# EAGLE design EMBEDDED (EAGLE 6.5.0)
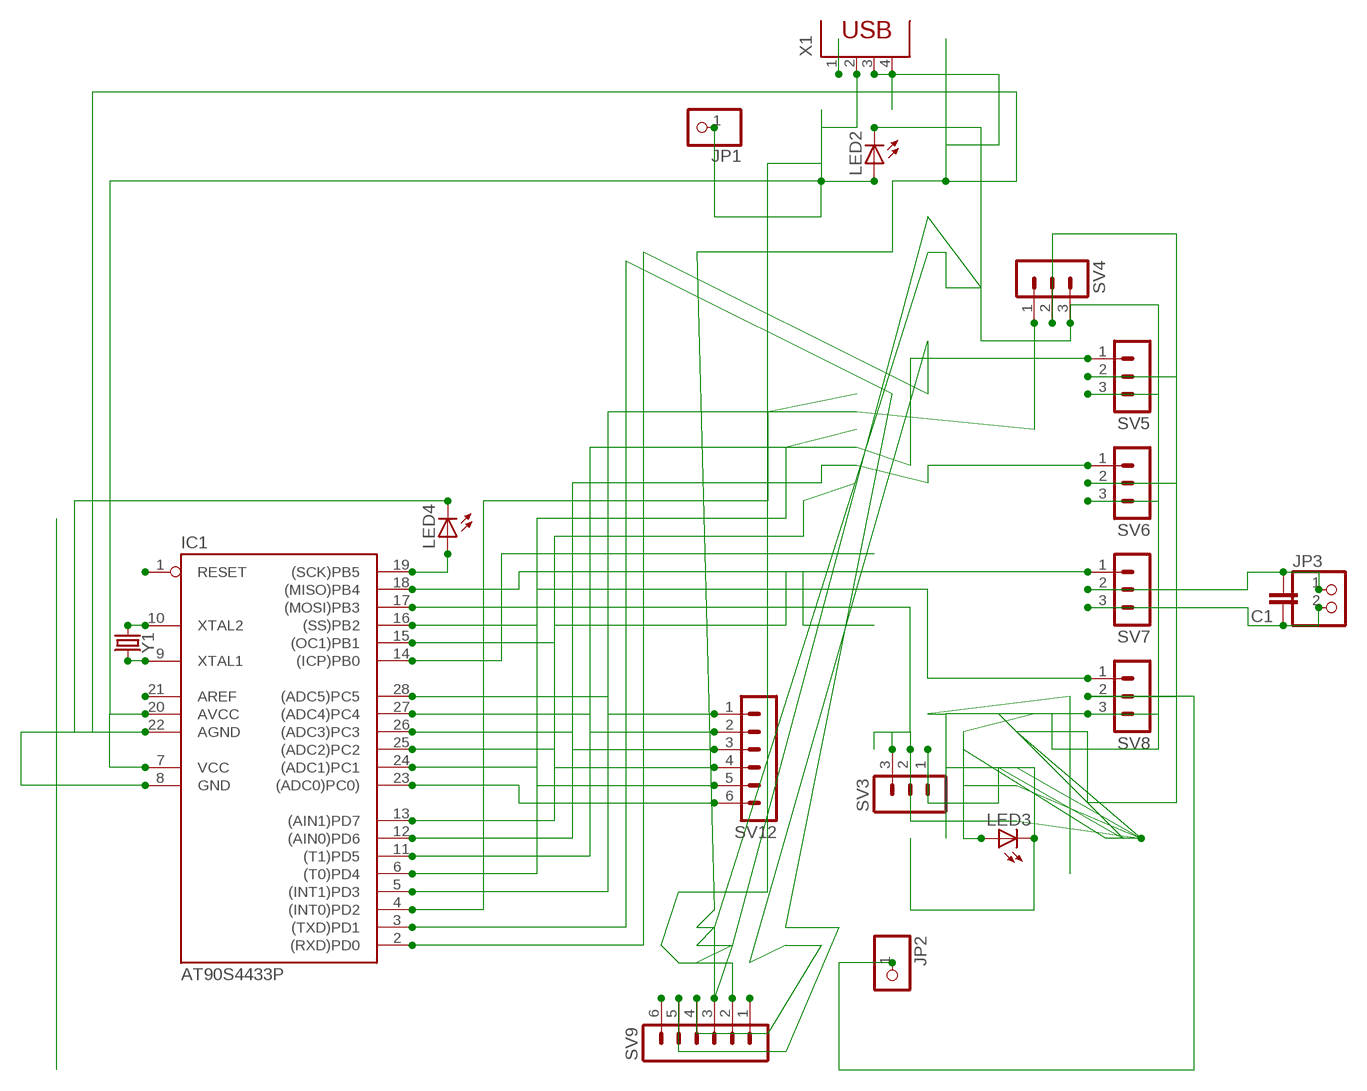
[diagram p0: schematic, sheet 1]

## Parts
C1  C5/2.5  [C5B2.5]
IC1  AT90S4433P  [DIL28-3]
JP1  PINHD-1X1  [1X01]
JP2  PINHD-1X1  [1X01]
JP3  PINHD-1X2  [1X02]
LED2  LEDLD260  [LD260]
LED3  LEDLD260  [LD260]
LED4  LEDLD260  [LD260]
SV3  MA03-1  [MA03-1]
SV4  MA03-1  [MA03-1]
SV5  MA03-1  [MA03-1]
SV6  MA03-1  [MA03-1]
SV7  MA03-1  [MA03-1]
SV8  MA03-1  [MA03-1]
SV9  MA06-1  [MA06-1]
SV12  MA06-1  [MA06-1]
X1  PN61729  [PN61729]
Y1  CRYSTALPTH-HC49US  [HC49US]

## Nets
GROUND: C1.1 IC1.8(GND) IC1.22(AGND) JP3.2 LED2.K(C) LED3.K(C) LED4.K(C) SV3.1 SV4.3 SV5.3 SV6.3 SV7.3 SV8.3 SV9.3 X1.3
N$1: IC1.17((MOSI)PB3) SV3.3
N$3: X1.1
N$4: X1.4
N$5: C1.2 JP2.1 JP3.1 LED3.A SV3.2 SV4.2 SV5.2 SV6.2 SV7.2 SV8.2
N$10: IC1.16((SS)PB2) SV8.1
N$12: IC1.15((OC1)PB1) SV7.1
N$15: IC1.12((AIN0)PD6) SV6.1
N$18: IC1.28((ADC5)PC5) SV12.1
N$19: IC1.11((T1)PD5) SV5.1
N$20: IC1.21(AREF)
N$21: IC1.9(XTAL1) Y1.2
N$22: IC1.5((INT1)PD3) SV4.1
N$23: SV9.6
N$24: IC1.27((ADC4)PC4) SV12.2
N$25: IC1.26((ADC3)PC3) SV12.3
N$26: IC1.2((RXD)PD0) SV9.4
N$27: IC1.3((TXD)PD1) SV9.5
N$28: SV9.1
N$29: IC1.25((ADC2)PC2) SV12.4
N$30: IC1.24((ADC1)PC1) SV12.5
N$31: IC1.23((ADC0)PC0)) SV12.6
N$32: IC1.10(XTAL2) Y1.1
N$33: IC1.1(RESET)
N$35: IC1.4((INT0)PD2)
N$37: IC1.6((T0)PD4)
N$40: IC1.13((AIN1)PD7)
N$41: IC1.14((ICP)PB0)
N$46: IC1.18((MISO)PB4)
N$54: IC1.19((SCK)PB5) LED4.A
VOLTAGE: IC1.7(VCC) IC1.20(AVCC) JP1.1 LED2.A SV9.2 X1.2

## Library data of the parts
C1 = capacitor-wima:C: CAPACITOR naming: grid - package width
IC1 = atmel:AT90S4433: MICROCONTROLLER 4 Kbytes FLASH 128 bytes SRAM 256 bytes EEPROM UART 6-channel 10 bit ADC; OC_FARNELL: unknown; OC_NEWARK: unknown
JP1 JP2 = pinhead:PINHD-1X1: PIN HEADER
JP3 = pinhead:PINHD-1X2: PIN HEADER
LED2-LED4 = led:LED: LED OSRAM: - CHIPLED LG R971, LG N971, LY N971, LG Q971, LY Q971, LO R971, LY R971 LH N974, LH R974 LS Q976, LO Q976, LY Q976 LO Q996 - Hyper CHIPLED LW Q18S LB Q993, LB Q99A, LB R99A - SideLED LS A670, LO A670, LY A670, LG A670, LP A670 LB A673, LV A673, LT A673, LW A673 LH A674 LY A675 LS A676, LA A676, LO A676, LY A676, LW A676 LS A679, LY A679, LG A679 - Hyper Micro SIDELED® LS Y876, LA Y876, LO Y876, LY Y876 LT Y87S - SmartLED LW L88C, LW L88S LB L89C, LB L89S, LG L890 LS L89K, LO L89K, LY L89K LS L896, LA L896, LO L896, LY L896 - TOPLED LS T670, LO T670, LY T670, LG T670, LP T670 LSG T670, LSP T670, LSY T670, LOP T670, LYG T670 LG T671, LOG T671, LSG T671 LB T673, LV T673, LT T673, LW T673 LH T674 LS T676, LA T676, LO T676, LY T676, LB T676, LH T676, LSB T676, LW T676 LB T67C, LV T67C, LT T67C, LS T67K, LO T67K, LY T67K, LW E67C LS E67B, LA E67B, LO E67B, LY E67B, LB E67C, LV E67C, LT E67C LW T67C LS T679, LY T679, LG T679 LS T770, LO T770, LY T770, LG T770, LP T770 LB T773, LV T773, LT T773, LW T773 LH T774 LS E675, LA E675, LY E675, LS T675 LS T776, LA T776, LO T776, LY T776, LB T776 LHGB T686 LT T68C, LB T68C - Hyper Mini TOPLED® LB M676 - Mini TOPLED Santana® LG M470 LS M47K, LO M47K, LY M47K Source: http://www.osram.convergy.de LUXEON: - LUMILED® LXK2-PW12-R00, LXK2-PW12-S00, LXK2-PW14-U00, LXK2-PW14-V00 LXK2-PM12-R00, LXK2-PM12-S00, LXK2-PM14-U00 LXK2-PE12-Q00, LXK2-PE12-R00, LXK2-PE12-S00, LXK2-PE14-T00, LXK2-PE14-U00 LXK2-PB12-K00, LXK2-PB12-L00, LXK2-PB12-M00, LXK2-PB14-N00, LXK2-PB14-P00, LXK2-PB14-Q00 LXK2-PR12-L00, LXK2-PR12-M00, LXK2-PR14-Q00, LXK2-PR14-R00 LXK2-PD12-Q00, LXK2-PD12-R00, LXK2-PD12-S00 LXK2-PH12-R00, LXK2-PH12-S00 LXK2-PL12-P00, LXK2-PL12-Q00, LXK2-PL12-R00 Source: www.luxeon.com KINGBRIGHT: KA-3528ASYC Source: www.kingbright.com
SV3-SV8 = con-lstb:MA03-1: PIN HEADER; OC_FARNELL: unknown; OC_NEWARK: unknown
SV9 SV12 = con-lstb:MA06-1: PIN HEADER; OC_FARNELL: unknown; OC_NEWARK: unknown
X1 = con-berg:PN61729: BERG USB connector; OC_FARNELL: unknown; OC_NEWARK: unknown
Y1 = SparkFun-Clocks:CRYSTAL: Crystals (Generic) These are passive quartz crystals, which can be used as a clock source for a microcontroller. Crystal's are two-terminal devices. They require external "load" capacitors to generate an oscillating signal.

## Board
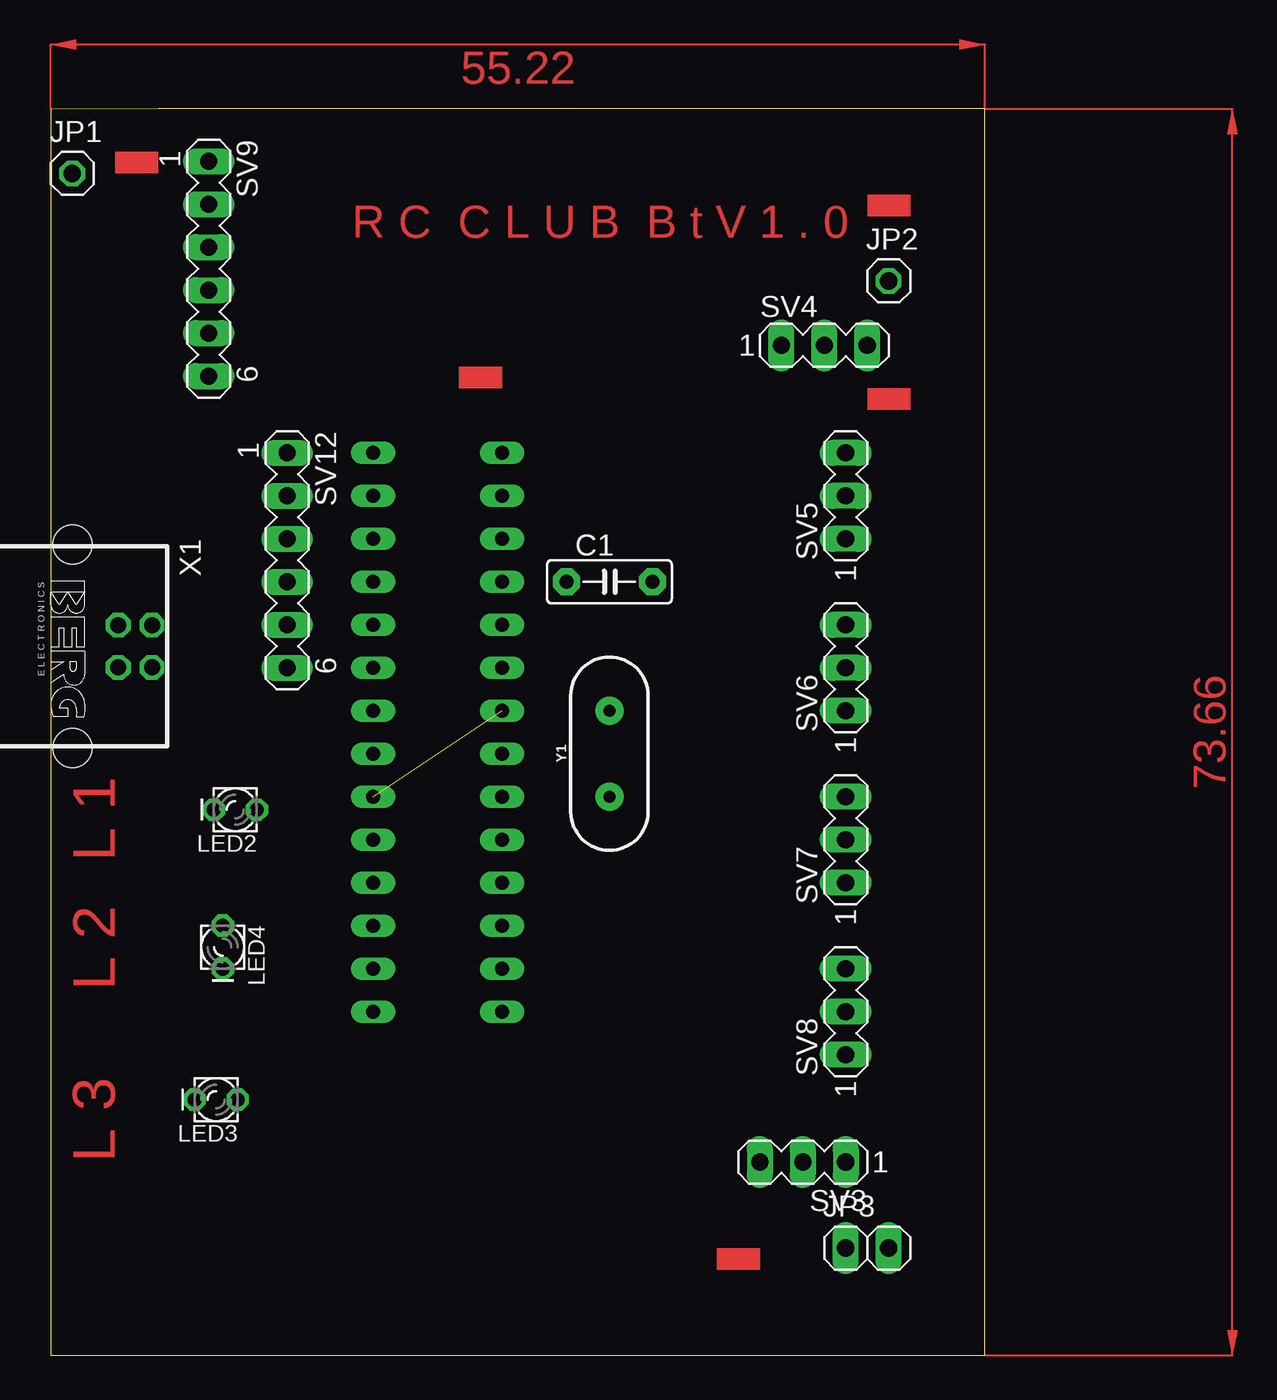
[diagram p1: board, top side]
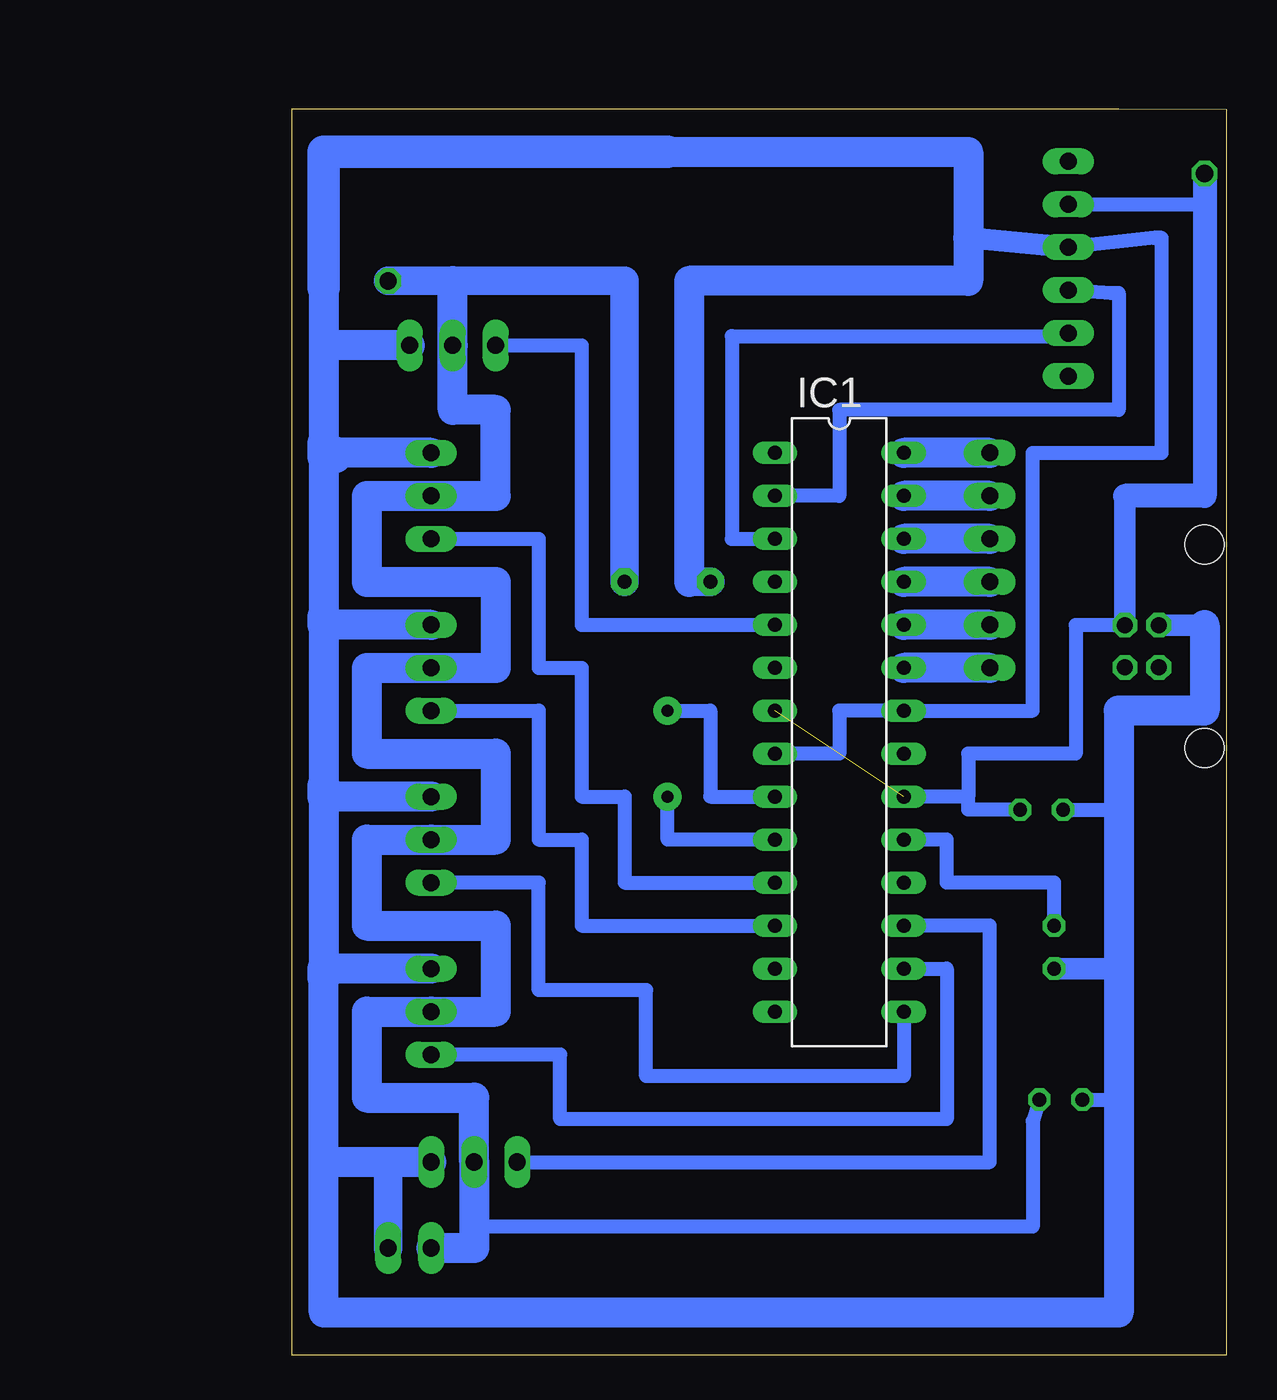
[diagram p2: board, bottom side, seen from below]

Size 55.22 x 73.66 mm. Coordinates in mm from the lower left corner, seen from the top.
Outline: 0,0 55.22,0 55.22,73.66 6.35,73.66 0,73.65 0,0
Copper layers (1*16): Top 0.035mm / dielectric 1.5mm / Bottom 0.035mm
Design rules "default": minimum track width 10mil, minimum drill 24mil, track to track 8mil, track to pad 8mil, pad to pad 8mil, via to via 8mil, smd to smd 8mil, copper to edge 40mil, drill to drill 8mil, minimum pad ring 10mil, minimum via ring 8mil, stop-mask expansion 4mil, vias tented up to drill 0mil, thermal gap 10mil

### Footprints (pad centres in the part's own frame; a part is rotated, then mirrored left to right if it is on the bottom)
C5B2.5 = drill 0.813 pad 1.6 octagon: 1 -2.54,0; 2 2.54,0
DIL28-3 = drill 0.813 long: 1 -16.51,-3.81; 2 -13.97,-3.81; 3 -11.43,-3.81; 4 -8.89,-3.81; 5 -6.35,-3.81; 6 -3.81,-3.81; 7 -1.27,-3.81; 8 1.27,-3.81; 9 3.81,-3.81; 10 6.35,-3.81; 11 8.89,-3.81; 12 11.43,-3.81; 13 13.97,-3.81; 14 16.51,-3.81; 15 16.51,3.81; 16 13.97,3.81; 17 11.43,3.81; 18 8.89,3.81; 19 6.35,3.81; 20 3.81,3.81; 21 1.27,3.81; 22 -1.27,3.81; 23 -3.81,3.81; 24 -6.35,3.81; 25 -8.89,3.81; 26 -11.43,3.81; 27 -13.97,3.81; 28 -16.51,3.81
1X01 = drill 1.016 octagon: 1 0,0
1X02 = drill 1.016 long: 1 -1.27,0; 2 1.27,0
LD260 = drill 0.813 octagon: A -1.27,0; K 1.27,0
MA03-1 = drill 1.016 long: 1 -2.54,0; 2 0,0; 3 2.54,0
MA06-1 = drill 1.016 long: 1 -6.35,0; 2 -3.81,0; 3 -1.27,0; 4 1.27,0; 5 3.81,0; 6 6.35,0
PN61729 = drill 0.95 octagon: 1 1.25,4.71; 2 -1.25,4.71; 3 -1.25,2.71; 4 1.25,2.71 | hole 2.3: -6.02,0; 6.02,0
HC49US = drill 0.7 pad 1.651: 1 -2.54,0; 2 2.54,0

### Placement (x,y rotation side)
C1  33.02,45.72 0 top
IC1  22.86,36.83 270 bottom
JP1  1.27,69.85 0 top
JP2  49.53,63.5 0 top
JP3  48.26,6.35 0 top
LED2  10.9,32.25 180 top
LED3  9.77,15.12 180 top
LED4  10.16,24.13 270 top
SV3  44.45,11.43 180 top
SV4  45.72,59.69 0 top
SV5  46.99,50.8 90 top
SV6  46.99,40.64 90 top
SV7  46.99,30.48 90 top
SV8  46.99,20.32 90 top
SV9  9.33,64.22 270 top
SV12  13.97,46.99 270 top
X1  1.27,41.91 270 top
Y1  33.02,35.56 90 top

### Tracks (layer width: path | path; a pad name or v marks a point on that pad's centre or on a via)
GROUND
  Bottom 0.406: 52.91,11.43 53.34,11.43
  Bottom 0.813: LED3.K 6.35,15.12 | IC1.8 22.86,35.56 22.86,38.1 IC1.22 11.43,38.1 11.43,53.34 3.81,53.34 3.81,66.04 4.25,66.04 SV9.3 | LED2.K 6.35,32.25
  Bottom 1.27: X1.3 1.27,43.16 | 15.24,66.04 SV9.3 | LED4.K 6.35,22.86
  Bottom 1.676: C1.1 31.75,45.72 | JP3.2 49.53,11.43
  Bottom 1.778: 53.34,63.1 53.34,59.69 | 53.34,59.69 53.34,53.92 | 53.34,43.66 53.34,53.34 SV5.3 | 53.34,33.67 53.34,43.18 SV6.3 | SV7.3 53.34,33.02 53.34,22.86 SV8.3 | SV3.1 49.53,11.43 52.91,11.43 | SV4.3 53.34,59.69 | 1.27,43.16 1.27,38.1 6.35,38.1 6.35,32.25 6.35,22.86 6.35,15.12 6.35,2.54 53.34,2.54 53.34,11.43 53.34,22.33 | 33.02,71.12 15.24,71.12 15.24,66.04 15.24,63.5 31.75,63.5 31.75,45.72
  Bottom 1.93: 53.34,22.86 53.34,22.33 | 53.34,33.02 53.34,33.67 | 53.34,43.18 53.34,43.66 | 52.64,53.34 52.64,53.11 53.34,53.11 53.34,53.34 53.34,53.92 | 33.02,71.12 53.34,71.12 53.34,63.1
N$1
  Bottom 0.813: SV3.3 13.97,11.43 13.97,25.4 IC1.17
N$5
  Bottom 0.813: LED3.A 11.43,13.85 11.43,7.62 44.45,7.62 44.45,6.35
  Bottom 1.676: C1.2 35.56,63.5 45.72,63.5 JP2.1
  Bottom 1.778: 45.72,63.5 SV4.2 45.72,55.88 43.18,55.88 43.18,50.8 SV5.2 50.8,50.8 50.8,45.72 43.18,45.72 43.18,40.64 SV6.2 50.8,40.64 50.8,35.56 43.18,35.56 43.18,30.48 SV7.2 50.8,30.48 50.8,25.4 43.18,25.4 43.18,20.32 SV8.2 50.8,20.32 50.8,15.24 44.45,15.24 SV3.2 44.45,6.35 JP3.1
N$10
  Bottom 0.813: IC1.16 16.51,22.86 16.51,13.97 39.37,13.97 39.37,17.78 SV8.1
N$12
  Bottom 0.813: IC1.15 19.05,16.51 34.29,16.51 34.29,21.59 40.64,21.59 40.64,27.94 SV7.1
N$15
  Bottom 0.813: SV6.1 40.64,38.1 40.64,30.48 38.1,30.48 38.1,25.4 IC1.12
N$18
  Bottom 1.778: SV12.1 IC1.28
N$19
  Bottom 0.813: SV5.1 40.64,48.26 40.64,40.64 38.1,40.64 38.1,33.02 35.56,33.02 35.56,27.94 IC1.11
N$21
  Bottom 0.813: Y1.2 30.48,38.1 30.48,33.02 IC1.9
N$22
  Bottom 0.813: SV4.1 38.1,59.69 38.1,43.18 IC1.5
N$24
  Bottom 1.778: SV12.2 IC1.27
N$25
  Bottom 1.778: SV12.3 IC1.26
N$26
  Bottom 0.813: IC1.2 22.86,50.8 22.86,55.88 6.35,55.88 6.35,62.78 6.79,62.78 SV9.4
N$27
  Bottom 0.813: IC1.3 29.21,48.26 29.21,60.24 9.33,60.24 SV9.5
N$29
  Bottom 1.778: SV12.4 IC1.25
N$30
  Bottom 1.778: SV12.5 IC1.24
N$31
  Bottom 1.778: SV12.6 IC1.23
N$32
  Bottom 0.813: IC1.10 33.02,30.48 Y1.1
N$54
  Bottom 0.813: LED4.A 10.16,27.94 16.51,27.94 16.51,30.48 IC1.19
VOLTAGE  (1 unrouted)
  Bottom 0.813: 1.27,50.8 1.27,68.03 SV9.2 | 15.24,33.02 15.24,35.56 8.89,35.56 8.89,43.16 X1.2 | 15.24,33.02 IC1.20 | LED2.A 15.24,32.25 15.24,33.02
  Bottom 1.27: 5.98,50.8 X1.2
  Bottom 1.422: JP1.1 1.27,50.8 5.98,50.8
(copper drawn outside any net)
  shapes: Top area x7

### Text on the board
Top: R C C L U B B t V 1 . 0 | L 1 | L 2 | L 3